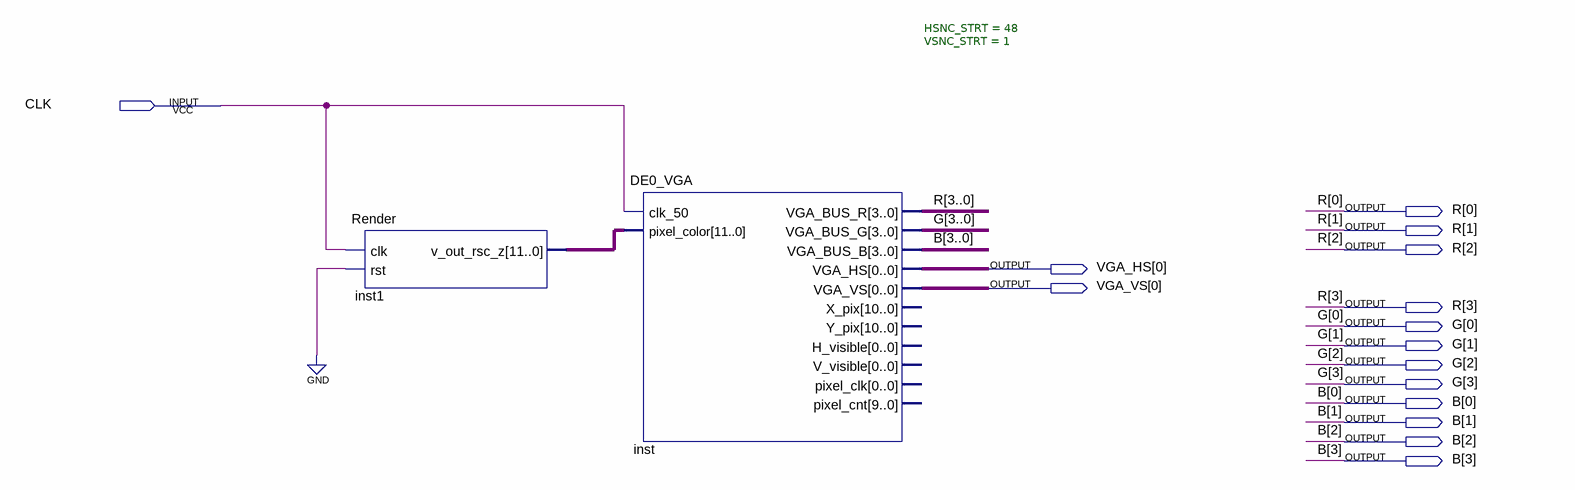
[diagram p0: schematic sheet]
// Quartus schematic Block2.bdf as structural Verilog: 2 symbols, 15 pins
module Block2 (
  input  CLK,
  output [3:0] R,
  output [0:0] VGA_HS,
  output [0:0] VGA_VS,
  output [3:0] G,
  output [3:0] B
);

  wire [11:0] inst1_v_out_rsc_z;

  Render inst1 (.clk(CLK), .rst(1'b0), .v_out_rsc_z(inst1_v_out_rsc_z));
  DE0_VGA #(.HSNC_STRT(48), .VSNC_STRT(1)) inst (
    .clk_50(CLK), .pixel_color(inst1_v_out_rsc_z), .VGA_BUS_R(R), .VGA_BUS_G(G), .VGA_BUS_B(B),
    .VGA_HS(VGA_HS[0]), .VGA_VS(VGA_VS[0]));  // open: X_pix, Y_pix, H_visible, V_visible, pixel_clk, pixel_cnt
endmodule
